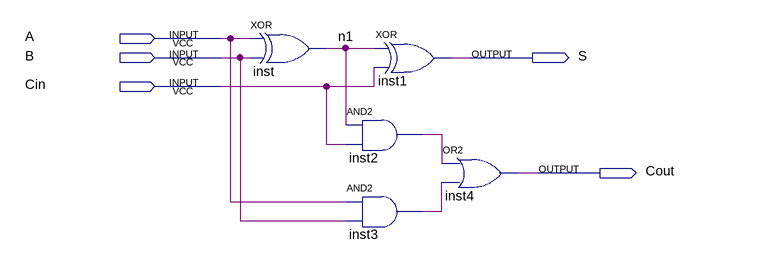
[diagram p0: schematic sheet]
// Quartus schematic full_adder.bdf as structural Verilog: 5 symbols, 5 pins
module full_adder (
  input  A,
  input  B,
  input  Cin,
  output S,
  output Cout
);

  wire inst2_out, inst3_out, n1;

  xor inst (n1, A, B);
  xor inst1 (S, n1, Cin);
  and inst2 (inst2_out, n1, Cin);
  and inst3 (inst3_out, A, B);
  or inst4 (Cout, inst2_out, inst3_out);
endmodule
